# EAGLE schematic Audio-2 (EAGLE 7.2.0)
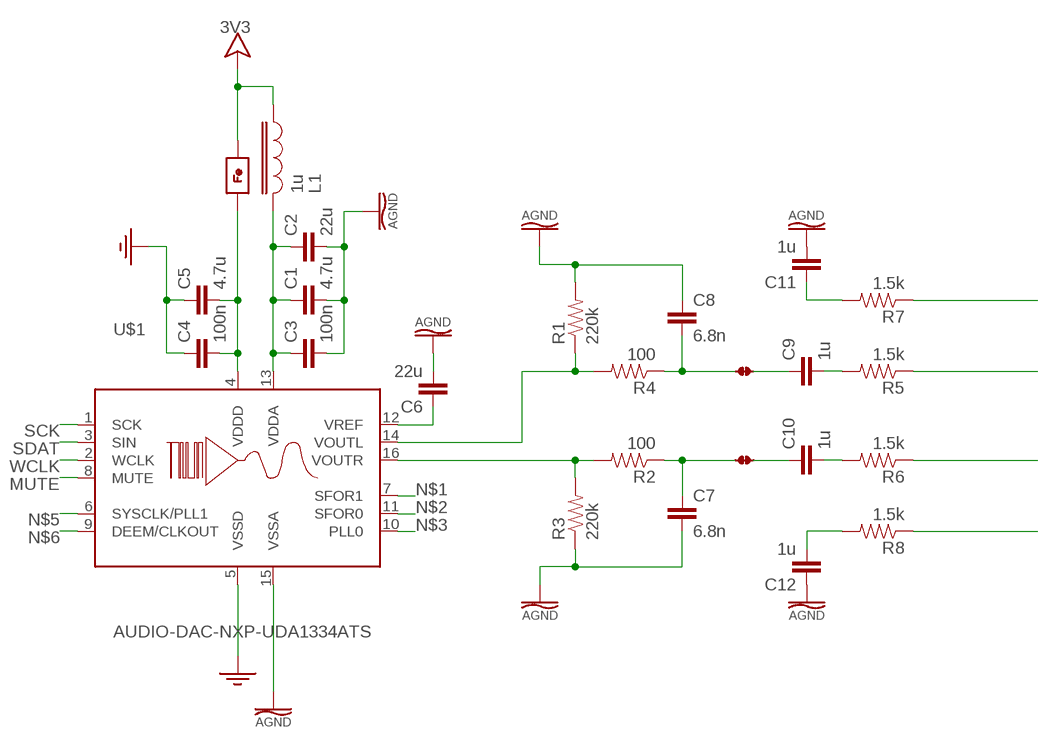
[diagram p0: schematic, sheet 1]

## Parts
C1  4.7u  CAP-0805-WIDE  [0805-WIDE]
C2  22u  CAP-1206-MIN  [1206-MIN]
C3  100n  CAP-0402  [0402]
C4  100n  CAP-0402  [0402]
C5  4.7u  CAP-0805-WIDE  [0805-WIDE]
C6  22u  CAP-1206-MIN  [1206-MIN]
C7  6.8n  CAP-0603  [0603]
C8  6.8n  CAP-0603  [0603]
C9  1u  CAP-0603  [0603]
C10  1u  CAP-0603  [0603]
C11  1u  CAP-0603  [0603]
C12  1u  CAP-0603  [0603]
FB1  FERRITE-BEAD-0603-MIN  [0603-MIN]
J1  JUMPER-0805  [0805-JUMPER]
J2  JUMPER-0805  [0805-JUMPER]
L1  1u  INDUCTOR-0805-MIN  [0805-MIN]
R1  220k  RESISTOR-0603  [0603]
R2  100  RESISTOR-0603  [0603]
R3  220k  RESISTOR-0603  [0603]
R4  100  RESISTOR-0603  [0603]
R5  1.5k  RESISTOR-0603  [0603]
R6  1.5k  RESISTOR-0603  [0603]
R7  1.5k  RESISTOR-0603  [0603]
R8  1.5k  RESISTOR-0603  [0603]
U$1  AUDIO-DAC-NXP-UDA1334ATS  [TSSOP16]

## Nets
3V3: FB1.2 L1.2 ; supply symbol labelled V
AGND: C1.1 C2.1 C3.1 C6.1 C7.1 C8.2 C11.1 C12.2 R1.2 R3.1 U$1.15(VSSA)
GND: C4.2 C5.2 U$1.5(VSSD)
MUTE: U$1.8(MUTE)
N$1: U$1.7(SFOR1)
N$2: U$1.11(SFOR0)
N$3: U$1.10(PLL0)
N$5: U$1.6(SYSCLK/PLL1)
N$6: U$1.9(DEEM/CLKOUT)
N$7: C4.1 C5.1 FB1.1 U$1.4(VDDD)
N$8: C1.2 C2.2 C3.2 L1.1 U$1.13(VDDA)
N$9: C6.2 U$1.12(VREF)
N$10: R1.1 R4.2 U$1.14(VOUTL)
N$11: R2.2 R3.2 U$1.16(VOUTR)
N$12: C7.2 J2.1 R2.1
N$13: C8.1 J1.1 R4.1
N$14: C10.2 J2.2
N$15: C9.2 J1.2
N$16: C9.1 R5.2
N$17: C10.1 R6.2
N$18: R5.1
N$19: C12.1 R8.2
N$20: C11.2 R7.2
N$21: R7.1
N$22: R6.1
N$23: R8.1
SCK: U$1.1(SCK)
SDAT: U$1.3(SIN)
WCLK: U$1.2(WCLK)

## Library data of the parts
C1-C12 = Outbreak:CAP
FB1 = Outbreak:FERRITE-BEAD
J1 J2 = Outbreak:JUMPER
L1 = Outbreak:INDUCTOR
R1-R8 = Outbreak:RESISTOR: Resistor Basic schematic elements and footprints for 0603, 1206, and PTH resistors.
U$1 = Outbreak:AUDIO-DAC-NXP-UDA1334ATS